# Altium schematic sheet arduinoHeader.SchDoc
size A4
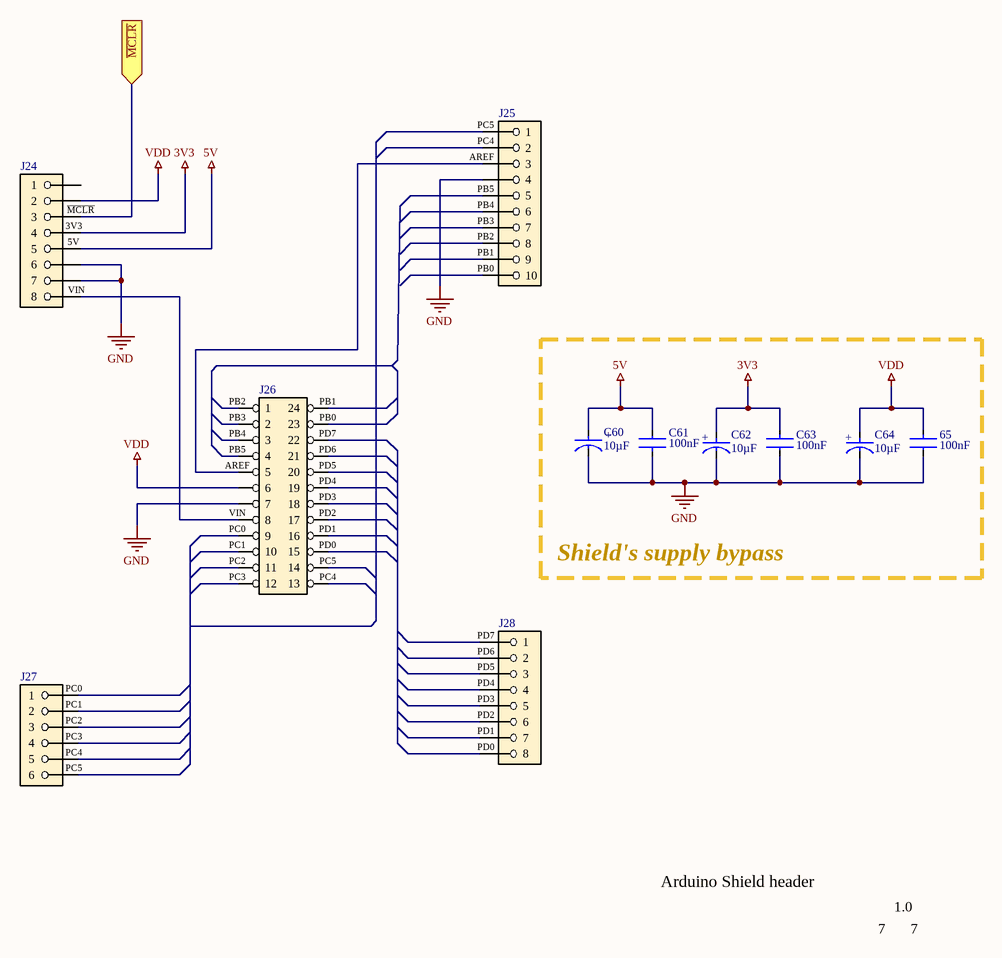
[diagram p0: arduinoHeader.SchDoc]

## Parts
65  value 100nF  [FP-C0805C-DN-MFG]  (hidden comment: C0805C102J5GACTU)
C60  Capacitance: 10µF  [FP-F98S-MFG]  (hidden comment: F981C106MSAAS1)
C61  value 100nF  [FP-C0805C-DN-MFG]  (hidden comment: C0805C102J5GACTU)
C62  Capacitance: 10µF  [FP-F98S-MFG]  (hidden comment: F981C106MSAAS1)
C63  value 100nF  [FP-C0805C-DN-MFG]  (hidden comment: C0805C102J5GACTU)
C64  Capacitance: 10µF  [FP-F98S-MFG]  (hidden comment: F981C106MSAAS1)
J24  Header 1x8 F  [Header 1x8]  (value not drawn)
J25  Header 1x10 F  [Header 1x10]  (value not drawn)
J26  Header 2x12  [Header 2x12]  (value not drawn)
J27  Header 1x6 F  [Header 1x6]  (value not drawn)
J28  Header 1x8 F  [Header 1x8]  (value not drawn)

## Blocks framed on the sheet
Shield's supply bypass: 65 C60-C64

## Ports
~{MCLR} (in)

## Nets
3V3: C62.2(A) C63.1 J24.4
5V: C60.2(A) C61.2 J24.5
GND: 65.2 C60.1(C) C61.1 C62.1(C) C63.2 C64.1(C) J24.6 J24.7 J25.4 J26.7
VDD: 65.1 C64.2(A) J24.2 J26.6
AREF: J25.3 J26.5
~{MCLR}: J24.3 ; port ~{MCLR}
PB0: J25.10 J26.23
PB1: J25.9 J26.24
PB2: J25.8 J26.1
PB3: J25.7 J26.2
PB4: J25.6 J26.3
PB5: J25.5 J26.4
PC0: J26.9 J27.1
PC1: J26.10 J27.2
PC2: J26.11 J27.3
PC3: J26.12 J27.4
PC4: J25.2 J26.13 J27.5
PC5: J25.1 J26.14 J27.6
PD0: J26.15 J28.8
PD1: J26.16 J28.7
PD2: J26.17 J28.6
PD3: J26.18 J28.5
PD4: J26.19 J28.4
PD5: J26.20 J28.3
PD6: J26.21 J28.2
PD7: J26.22 J28.1
VIN: J24.8 J26.8

Not connected (* = marked no-connect by the designer): J24 1

## Notes on the sheet
- Arduino Shield header
- 7
- 1.0
- Title:
- Size:
- Date:
- A4
- Number:
- Time:
- Revision:
- Sheet
- of
- Author:
- Krzysztof Pierczyk
- File:
- (in symbol CMP-04424-000018-1) +

## Library data of the parts
65 = CMP-03020-008364-1: CAP CER 1000PF 50V C0G/NP0 0805; Manufacturer: KEMET; Capacitance: 1,000 pF; Temperature Characteristic: C0G; Temperature Coefficient: 30ppm/°C; Tolerance: 0.05; Automotive: No; Voltage Rating: 50 V; Device Class L1: Passive Components; Digikey Description: CAP CER 1000PF 50V C0G/NP0 0805; Lead Free: Yes; Package: C0805C-DN; RoHS: TRUE; Temperature Range High: +125°C; Height: 0.88mm; Ipc Land Pattern Name: CAPC200125X78; Category: Cap; ComponentLink2URL: https://content.kemet.com/datasheets/KEM_C1003_C0G_SMD.pdf; Device Class L2: Capacitors; ComponentLink2Description: Datasheet; Temperature: -55°C to +125°C; Octopart: https://octopart.com/c0805c102j5gactu-kemet-97757; Mouser Description: Multilayer Ceramic Capacitors MLCC - SMD/SMT 50volts 1000pF C0G 5%; Manufacturer Part Number: C0805C102J5GACTU; Material: Ceramic; Device Class L3: Ceramic Capacitors; Temperature Range Low: -55°C
C60 C62 C64 = CMP-04424-000018-1: CAP TANT 10UF 20% 16V 0805; Manufacturer: AVX; Esr: 4.5Ω; Material: Tantalum; Ripple Current: 100mA; Leakage Current: 1.6uA; Life: 1000Hours; Dissipation Factor: 18%; Temperature Range High: +125°C; Temperature: -55°C to +125°C; Digikey Description: CAP TANT 10UF 20% 16V 0805; Tolerance: 20%; Automotive: No; Voltage Rating: 16V; Device Class L3: Tantalum Capacitors; Package: F98S; Device Class L2: Capacitors; Footprint Url: https://www.avx.com/download/software/literature/AVX-Footprint-Library.pdf; Mouser Description: Cap Tant Solid 10uF 16V S CASE 20% (2 x 1.25 x 0.8mm) SMD 2012-09 4.5Ohm 125°C T/R; Value: 10uF; ComponentLink2URL: http://datasheets.avx.com/F98-AS1.pdf; Height: 0.9mm; Manufacturer Part Number: F981C106MSAAS1; ComponentLink2Description: Datasheet; Lead Free: Yes; Category: Cap; Temperature Coefficient: 20%; RoHS: TRUE; Temperature Range Low: -55°C; Octopart: https://octopart.com/f981c106msaas1-avx-49645945; Device Class L1: Passive Components
C61 C63 = CMP-03020-008364-1: CAP CER 1000PF 50V C0G/NP0 0805; Manufacturer: KEMET; Capacitance: 1,000 pF; Temperature Characteristic: C0G; Material: Ceramic; Temperature Coefficient: 30ppm/°C; Tolerance: 0.05; Automotive: No; Voltage Rating: 50 V; Device Class L1: Passive Components; Digikey Description: CAP CER 1000PF 50V C0G/NP0 0805; Lead Free: Yes; Package: C0805C-DN; RoHS: TRUE; Temperature Range High: +125°C; Height: 0.88mm; Ipc Land Pattern Name: CAPC200125X78; Category: Cap; ComponentLink2URL: https://content.kemet.com/datasheets/KEM_C1003_C0G_SMD.pdf; Device Class L2: Capacitors; ComponentLink2Description: Datasheet; Temperature: -55°C to +125°C; Octopart: https://octopart.com/c0805c102j5gactu-kemet-97757; Mouser Description: Multilayer Ceramic Capacitors MLCC - SMD/SMT 50volts 1000pF C0G 5%; Manufacturer Part Number: C0805C102J5GACTU; Device Class L3: Ceramic Capacitors; Temperature Range Low: -55°C